# Altium schematic sheet analog.SchDoc
size A4; SheetNumber: 5; SheetTotal: 6
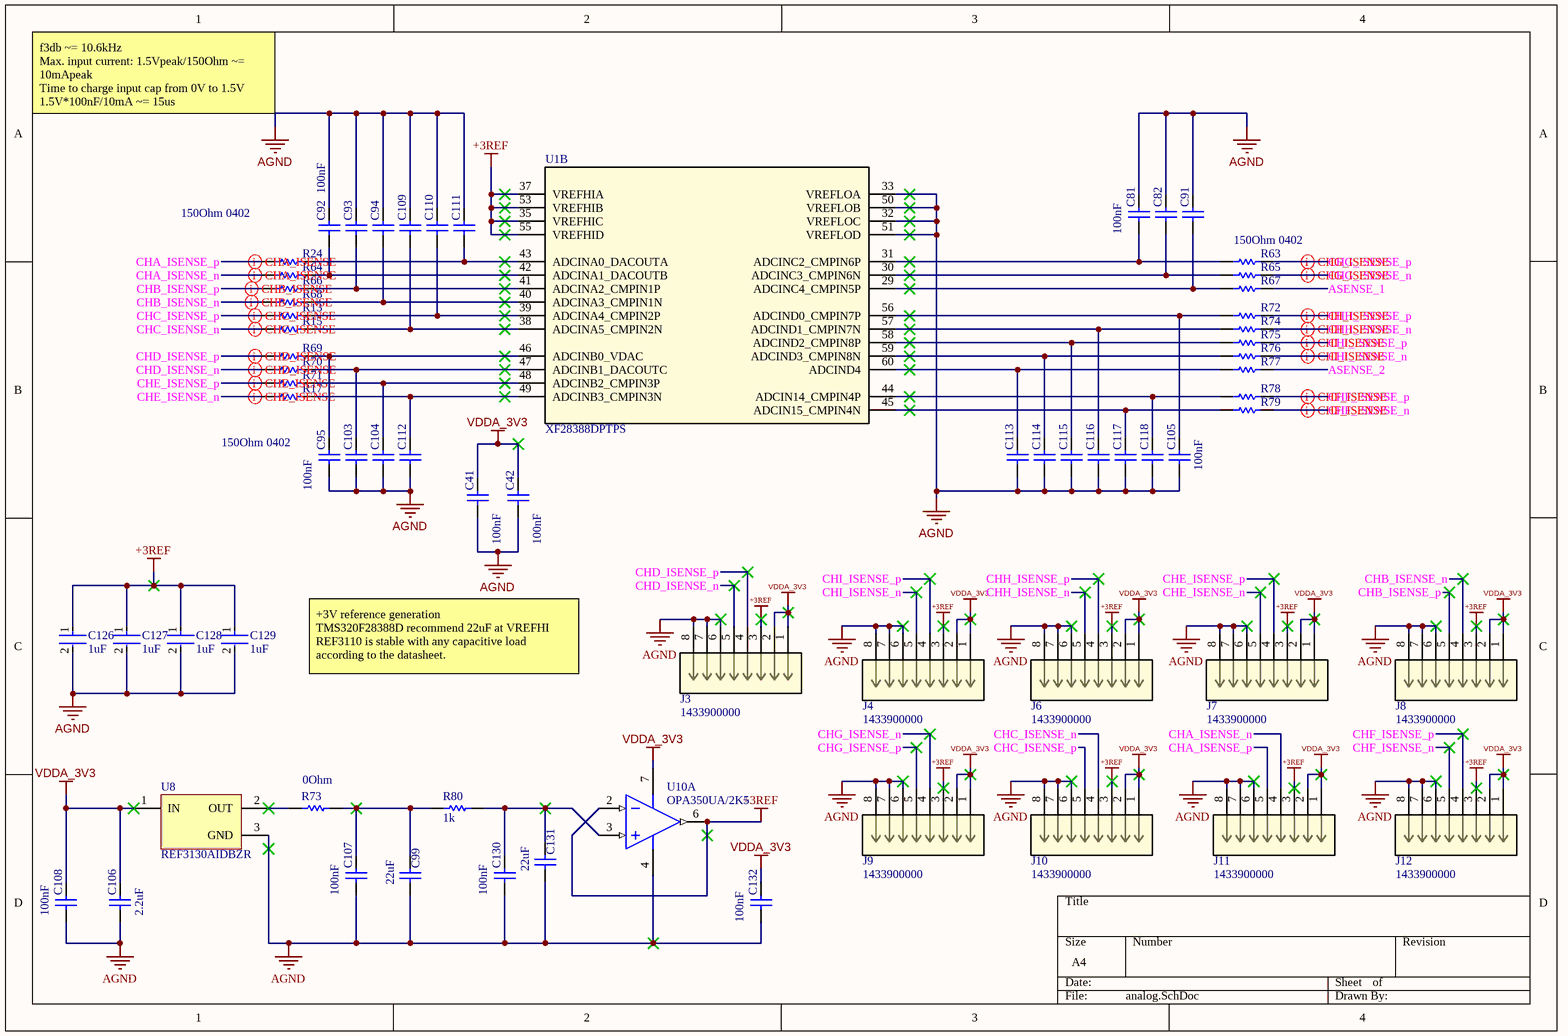
[diagram p0: analog.SchDoc]

## Parts
C41  100nF  [CAP 0402_1005]
C42  100nF  [CAP 0402_1005]
C81  100nF  [CAP 0402_1005]
C82  100nF  [CAP 0402_1005]  (value not drawn)
C91  100nF  [CAP 0402_1005]  (value not drawn)
C92  100nF  [CAP 0402_1005]
C93  100nF  [CAP 0402_1005]  (value not drawn)
C94  100nF  [CAP 0402_1005]  (value not drawn)
C95  100nF  [CAP 0402_1005]
C99  22uF  [CAP 0805_2012]
C103  100nF  [CAP 0402_1005]  (value not drawn)
C104  100nF  [CAP 0402_1005]  (value not drawn)
C105  100nF  [CAP 0402_1005]
C106  2.2uF  [CAP 0603_1608]
C107  100nF  [CAP 0402_1005]
C108  100nF  [CAP 0402_1005]
C109  100nF  [CAP 0402_1005]  (value not drawn)
C110  100nF  [CAP 0402_1005]  (value not drawn)
C111  100nF  [CAP 0402_1005]  (value not drawn)
C112  100nF  [CAP 0402_1005]  (value not drawn)
C113  100nF  [CAP 0402_1005]  (value not drawn)
C114  100nF  [CAP 0402_1005]  (value not drawn)
C115  100nF  [CAP 0402_1005]  (value not drawn)
C116  100nF  [CAP 0402_1005]  (value not drawn)
C117  100nF  [CAP 0402_1005]  (value not drawn)
C118  100nF  [CAP 0402_1005]  (value not drawn)
C126  1uF  [FP-C0402C105K8PACTU-MFG]
C127  1uF  [FP-C0402C105K8PACTU-MFG]
C128  1uF  [FP-C0402C105K8PACTU-MFG]
C129  1uF  [FP-C0402C105K8PACTU-MFG]
C130  100nF  [CAP 0402_1005]
C131  22uF  [CAP 0805_2012]
C132  100nF  [CAP 0402_1005]
J3  1433900000  [CONN8_1433900000_WED]
J4  1433900000  [CONN8_1433900000_WED]
J6  1433900000  [CONN8_1433900000_WED]
J7  1433900000  [CONN8_1433900000_WED]
J8  1433900000  [CONN8_1433900000_WED]
J9  1433900000  [CONN8_1433900000_WED]
J10  1433900000  [CONN8_1433900000_WED]
J11  1433900000  [CONN8_1433900000_WED]
J12  1433900000  [CONN8_1433900000_WED]
R13  150Ohm 0402  [RESC1005X40X25LL05T10]  (value not drawn)
R15  150Ohm 0402  [RESC1005X40X25LL05T10]  (value not drawn)
R17  150Ohm 0402  [RESC1005X40X25LL05T10]  (value not drawn)
R24  150Ohm 0402  [RESC1005X40X25LL05T10]  (value not drawn)
R63  150Ohm 0402  [RESC1005X40X25LL05T10]
R64  150Ohm 0402  [RESC1005X40X25LL05T10]
R65  150Ohm 0402  [RESC1005X40X25LL05T10]  (value not drawn)
R66  150Ohm 0402  [RESC1005X40X25LL05T10]  (value not drawn)
R67  150Ohm 0402  [RESC1005X40X25LL05T10]  (value not drawn)
R68  150Ohm 0402  [RESC1005X40X25LL05T10]  (value not drawn)
R69  150Ohm 0402  [RESC1005X40X25LL05T10]
R70  150Ohm 0402  [RESC1005X40X25LL05T10]  (value not drawn)
R71  150Ohm 0402  [RESC1005X40X25LL05T10]  (value not drawn)
R72  150Ohm 0402  [RESC1005X40X25LL05T10]  (value not drawn)
R73  0Ohm  [RES 0603_1608]
R74  150Ohm 0402  [RESC1005X40X25LL05T10]  (value not drawn)
R75  150Ohm 0402  [RESC1005X40X25LL05T10]  (value not drawn)
R76  150Ohm 0402  [RESC1005X40X25LL05T10]  (value not drawn)
R77  150Ohm 0402  [RESC1005X40X25LL05T10]  (value not drawn)
R78  150Ohm 0402  [RESC1005X40X25LL05T10]  (value not drawn)
R79  150Ohm 0402  [RESC1005X40X25LL05T10]  (value not drawn)
R80  1k  [RES 0402_1005]
U1  XF28388DPTPS  [PTP0176F-IPC_A]  (part B of 5)
U8  REF3130AIDBZR  [DBZ0003A_N]
U10  OPA350UA/2K5  [D0008A_N]  (part A of 2)

## Nets
+3REF: C126.1 C127.1 C128.1 C129.1 J3.3 J4.3 J6.3 J7.3 J8.3 J9.3 J10.3 J11.3 J12.3 U1.35(VREFHIC) U1.37(VREFHIA) U1.53(VREFHIB) U1.55(VREFHID) U10.2(IN-) U10.6(OUT)
AGND: C41.1 C42.1 C81.2 C82.2 C91.2 C92.2 C93.2 C94.2 C95.1 C99.1 C103.1 C104.1 C105.1 C106.1 C107.1 C108.1 C109.2 C110.2 C111.2 C112.1 C113.1 C114.1 C115.1 C116.1 C117.1 C118.1 C126.2 C127.2 C128.2 C129.2 C130.1 C131.1 C132.1 J3.6 J3.7 J3.8 J4.6 J4.7 J4.8 J6.6 J6.7 J6.8 J7.6 J7.7 J7.8 J8.6 J8.7 J8.8 J9.6 J9.7 J9.8 J10.6 J10.7 J10.8 J11.6 J11.7 J11.8 J12.6 J12.7 J12.8 U1.32(VREFLOC) U1.33(VREFLOA) U1.50(VREFLOB) U1.51(VREFLOD) U8.3(GND) U10.4(V-)
VDDA_3V3: C41.2 C42.2 C106.2 C108.2 C132.2 J3.1 J3.2 J4.1 J4.2 J6.1 J6.2 J7.1 J7.2 J8.1 J8.2 J9.1 J9.2 J10.1 J10.2 J11.1 J11.2 J12.1 J12.2 U8.1(IN) U10.7(V+)
ASENSE_1: R67.2
ASENSE_2: R77.2
CHA_ISENSE_n: J11.4 R64.1
CHA_ISENSE_p: J11.5 R24.1
CHB_ISENSE_n: J8.4 R68.1
CHB_ISENSE_p: J8.5 R66.1
CHC_ISENSE_n: J10.4 R15.1
CHC_ISENSE_p: J10.5 R13.1
CHD_ISENSE_n: J3.5 R70.1
CHD_ISENSE_p: J3.4 R69.1
CHE_ISENSE_n: J7.5 R17.1
CHE_ISENSE_p: J7.4 R71.1
CHF_ISENSE_n: J12.5 R79.2
CHF_ISENSE_p: J12.4 R78.2
CHG_ISENSE_n: J9.4 R65.2
CHG_ISENSE_p: J9.5 R63.2
CHH_ISENSE_n: J6.5 R74.2
CHH_ISENSE_p: J6.4 R72.2
CHI_ISENSE_n: J4.5 R76.2
CHI_ISENSE_p: J4.4 R75.2
NetC81_1: C81.1 R63.1 U1.31(ADCINC2_CMPIN6P)
NetC82_1: C82.1 R65.1 U1.30(ADCINC3_CMPIN6N)
NetC91_1: C91.1 R67.1 U1.29(ADCINC4_CMPIN5P)
NetC92_1: C92.1 R64.2 U1.42(ADCINA1_DACOUTB)
NetC93_1: C93.1 R66.2 U1.41(ADCINA2_CMPIN1P)
NetC94_1: C94.1 R68.2 U1.40(ADCINA3_CMPIN1N)
NetC95_2: C95.2 R69.2 U1.46(ADCINB0_VDAC)
NetC99_2: C99.2 C107.2 R73.2 R80.1
NetC103_2: C103.2 R70.2 U1.47(ADCINB1_DACOUTC)
NetC104_2: C104.2 R71.2 U1.48(ADCINB2_CMPIN3P)
NetC105_2: C105.2 R72.1 U1.56(ADCIND0_CMPIN7P)
NetC109_1: C109.1 R15.2 U1.38(ADCINA5_CMPIN2N)
NetC110_1: C110.1 R13.2 U1.39(ADCINA4_CMPIN2P)
NetC111_1: C111.1 R24.2 U1.43(ADCINA0_DACOUTA)
NetC112_2: C112.2 R17.2 U1.49(ADCINB3_CMPIN3N)
NetC113_2: C113.2 R77.1 U1.60(ADCIND4)
NetC114_2: C114.2 R76.1 U1.59(ADCIND3_CMPIN8N)
NetC115_2: C115.2 R75.1 U1.58(ADCIND2_CMPIN8P)
NetC116_2: C116.2 R74.1 U1.57(ADCIND1_CMPIN7N)
NetC117_2: C117.2 R79.1 U1.45(ADCIN15_CMPIN4N)
NetC118_2: C118.2 R78.1 U1.44(ADCIN14_CMPIN4P)
NetC130_2: C130.2 C131.2 R80.2 U10.3(IN+)
NetR73_1: R73.1 U8.2(OUT)

## Layout directives
differential pair: CHA_ISENSE_n, CHA_ISENSE_p, CHB_ISENSE_n, CHB_ISENSE_p, CHC_ISENSE_n, CHC_ISENSE_p, CHD_ISENSE_n, CHD_ISENSE_p, CHE_ISENSE_n, CHE_ISENSE_p, CHF_ISENSE_n, CHF_ISENSE_p, CHG_ISENSE_n, CHG_ISENSE_p, CHH_ISENSE_n, CHH_ISENSE_p, CHI_ISENSE_n, CHI_ISENSE_p

## Notes on the sheet
- f3db ~= 10.6kHz
  Max. input current: 1.5Vpeak/150Ohm ~= 10mApeak
  Time to charge input cap from 0V to 1.5V
  1.5V*100nF/10mA ~= 15us
- +3V reference generation
  TMS320F28388D recommend 22uF at VREFHI
  REF3110 is stable with any capacitive load according to the datasheet.

## Library data of the parts
C41 C42 C81 C82 C91-C95 C103-C105 C107-C118 C130 C132 = Cap: MLCC 100nF 0402 10V; Published: 8-Jun-2000; LatestRevisionDate: 17-Jul-2002; LatestRevisionNote: Re-released for DXP Platform.; PackageReference: RAD-0.3; Publisher: Altium Limited; PackageDescription: Radial Cap, Thru-Hole; 2 Leads; 0.3 in Pin Spacing; Value: 100nF
  C41: Supplier: Digikey; Supplier Part Number: 445-6902-1-ND
  C81 C82 C91-C95 C103-C105 C107-C118 C130 C132: Supplier 1: Arrow Electronics; Supplier Part Number 1: C0402C104K8PACTU
C99 C131 = Cap: MLCC 22uF 0805 5V; Published: 8-Jun-2000; LatestRevisionDate: 17-Jul-2002; LatestRevisionNote: Re-released for DXP Platform.; PackageReference: RAD-0.3; Publisher: Altium Limited; PackageDescription: Radial Cap, Thru-Hole; 2 Leads; 0.3 in Pin Spacing; Value: 22uF
C106 = Cap: MLCC 2.2uF 0603 10V; Published: 8-Jun-2000; LatestRevisionDate: 17-Jul-2002; LatestRevisionNote: Re-released for DXP Platform.; PackageReference: RAD-0.3; Publisher: Altium Limited; PackageDescription: Radial Cap, Thru-Hole; 2 Leads; 0.3 in Pin Spacing; Value: 2.2uF
C126-C129 = CMP-2008-02081-2: MLCC 1uF 0402; Dielectric Material: Ceramic; Voltage Rating (DC): 10V; Dissipation Factor: 5%; Dielectric: X5R; Tolerance: 10%; Number of Pins: 2; Contact Plating: Tin; Min Operating Temperature: -55°C; Termination: SMD/SMT; Lead Free: Lead Free; Construction: Flat; Mount: Surface Mount; Series: C; Thickness: 0.022inch; Width: 0.5mm; Radiation Hardening: No; Capacitance: 1uF; Height: 0.5mm; Voltage: 10V; Length: 1mm; Depth: 0.5mm; Max Operating Temperature: 85°C; Package Quantity: 1; Packaging: Tape and Reel; RoHS Compliant: Yes; Case Code (Imperial): 0402; Case Code (Metric): 1005; REACH SVHC: No SVHC; Voltage Rating: 10V; Case/Package: 0402
J3 J4 J6-J12 = 1433900000: No Description Available; Mfr_Name: Weidmuller; RefDes: RefDes; Type: Type; Supplier 1: Digikey; Supplier Part Number 1: 281-6784-1-ND
R13 R15 R17 R24 R63-R72 R74-R79 = RES: Resistor 150Ohm 0402; Part Number: RC0402FR-07150RL; Manufacturer: Yageo / Phycomp
R73 = Res1: Resistor 0Ohm 0603; Value: 22k; Published: 8-Jun-2000; LatestRevisionDate: 17-Jul-2002; LatestRevisionNote: Re-released for DXP Platform.; PackageReference: AXIAL-0.3; Publisher: Altium Limited; PackageDescription: Axial Device, Thru-Hole; 2 Leads; 0.3 in Pin Spacing; Supplier 1: Future Electronics; Supplier Part Number 1: 3375797
R80 = Res1: Resistor 1kOhm 0402; Value: 2.2k; Published: 8-Jun-2000; LatestRevisionDate: 17-Jul-2002; LatestRevisionNote: Re-released for DXP Platform.; PackageReference: AXIAL-0.3; Publisher: Altium Limited; PackageDescription: Axial Device, Thru-Hole; 2 Leads; 0.3 in Pin Spacing; Supplier 1: Future Electronics; Supplier Part Number 1: 2136083
U1 = XF28388DPTPS: Mfr_Name: Texas Instruments; TYPE: TYPE; RefDes: RefDes
U8 = CMP-0367-00139-2: 20 ppm / degC Max, 100 uA Series Voltage Reference, -40 to 125 degC, 3-pin SOT-23 (DBZ), Green (RoHS & no Sb/Br); Manufacturer: Texas Instruments; Temp Coeff(Max)(ppm/ degree C): 20; Temp Coeff(Typ)(ppm/ degree C): 10; VO(V): 3; Rating: Catalog; Iq(Max)(uA): 100; Initial Accuracy @ 25/deg C(%): 0.2; VI(Min)(V): 3.05; VI(Max)(V): 5.5; ComponentLink1Description: Manufacturer URL; PackageDescription: 3-Pin Plastic Small Outline, Body 2.92 x 1.3 mm, Pitch 0.95 mm; ComponentLink3URL: http://www.ti.com/litv/pdf/mpds108a; ComponentLink2URL: http://www.ti.com/lit/ds/symlink/ref3130.pdf; Mounting Technology: Surface Mount; ComponentLink2Description: Datasheet; SubFamily: Series Voltage Reference; Eco-Plan: Green (RoHS & no Sb/Br); ComponentLink3Description: Package Specification; PackageReference: DBZ0003A; DatasheetVersion: SBVS046C; PartNumber: REF3130AIDBZR; ComponentLink1URL: http://www.ti.com/; PackageVersion: 4203227/B; Code_JEDEC: TO-236
U10 = CMP-0272-00632-3: High-Speed, Single-Supply, Rail-to-Rail Operational Amplifier MicroAmplifier(TM) Series, 2.7 to 5.5 V, -40 to 85 degC, 8-pin SOIC (D8), Green (RoHS & no Sb/Br); Manufacturer: Texas Instruments; Vn at 1kHz(Typ)(nV/rtHz): 18; Total Supply Voltage(Min)(+5V is 5, +/-5V is 10): 2.7; Number of Channels: 1; Sub Family: Low Input Bias Current Amp (<=10pA), Low Offset Voltage Amplifier (<=500uV), Low Supply Voltage Amplifier (<=2.7V), Precision Amplifier; Total Supply Voltage(Max)(+5V is 5, +/-5V is 10): 5.5; Iq per channel(Max)(mA): 8.5; CMRR(Min)(dB): 66; IIB(Max)(pA): 10; Slew Rate(Typ)(V/us): 22; Offset Drift(Typ)(uV/C): 4; DatasheetVersion: SBOS099C; ComponentLink3URL: http://www.ti.com/litv/pdf/msoi002j; PackageDescription: 8-Pin Plastic Small Outline, Body 4.9 x 3.9 mm, Pitch 1.27 mm; ComponentLink3Description: Package Specification; ComponentLink1Description: Manufacturer URL; ComponentLink2URL: http://www.ti.com/general/docs/lit/getliterature.tsp?genericPartNumber=OPA350&fileType=pdf; ComponentLink2Description: Datasheet; PartNumber: OPA350UA/2K5; Mounting Technology: Surface Mount; PackageReference: D0008A; ComponentLink1URL: http://www.ti.com/; Vio (25C)(Max)(mV): 1; Code_JEDEC: MS-012; Eco-Plan: Green (RoHS & no Sb/Br); PackageVersion: 4040047-3/M, 06/2011